# Altium project sdram.PrjPcb
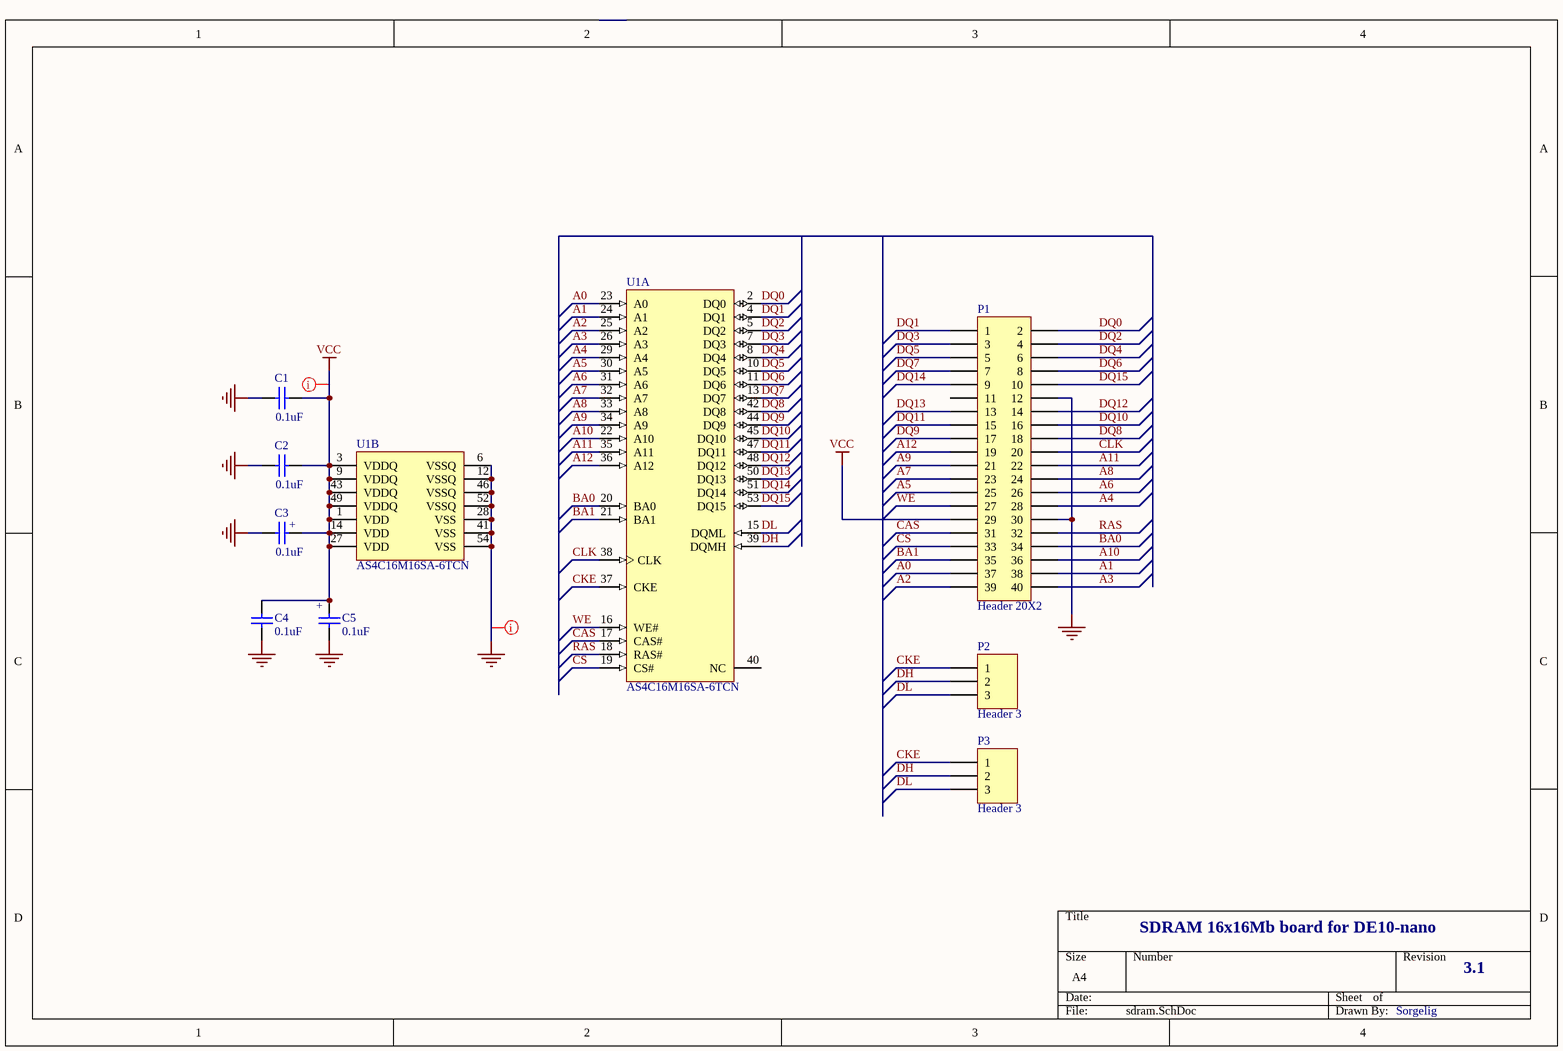
[diagram p0: sdram.SchDoc]
1 sheet, 9 parts. Net scope: global (net labels, ports and power ports of the same name join across sheets).
Board file: sdram.PcbDoc

## Sheet sdram.SchDoc
size A4

### Parts
C1  value 0.1uF  [0805]  (hidden comment: C0805)
C2  value 0.1uF  [0805]  (hidden comment: C0805)
C3  +  value 0.1uF  [0805]
C4  value 0.1uF  [0805]  (hidden comment: C0805)
C5  +  value 0.1uF  [0805]
P1  Header 20X2  [HDR2X20]
P2  Header 3  [HDR1X3]
P3  Header 3  [HDR1X3]
U1  AS4C16M16SA-6TCN  [MICT-P-54_N]  (parts A,B of 2)

### Nets
GND: C1.1 C2.1 C3.1 C4.1 C5.1 P1.12 P1.30 U1.6(VSSQ) U1.12(VSSQ) U1.28(VSS) U1.41(VSS) U1.46(VSSQ) U1.52(VSSQ) U1.54(VSS)
VCC: C1.2 C2.2 C3.2 C4.2 C5.2 P1.29 U1.1(VDD) U1.3(VDDQ) U1.9(VDDQ) U1.14(VDD) U1.27(VDD) U1.43(VDDQ) U1.49(VDDQ)
A0: P1.37 U1.23(A0)
A1: P1.38 U1.24(A1)
A2: P1.39 U1.25(A2)
A3: P1.40 U1.26(A3)
A4: P1.28 U1.29(A4)
A5: P1.25 U1.30(A5)
A6: P1.26 U1.31(A6)
A7: P1.23 U1.32(A7)
A8: P1.24 U1.33(A8)
A9: P1.21 U1.34(A9)
A10: P1.36 U1.22(A10)
A11: P1.22 U1.35(A11)
A12: P1.19 U1.36(A12)
BA0: P1.34 U1.20(BA0)
BA1: P1.35 U1.21(BA1)
CAS: P1.31 U1.17(CAS#)
CKE: P2.1 P3.1 U1.37(CKE)
CLK: P1.20 U1.38(CLK)
CS: P1.33 U1.19(CS#)
DH: P2.2 P3.2 U1.39(DQMH)
DL: P2.3 P3.3 U1.15(DQML)
DQ0: P1.2 U1.2(DQ0)
DQ1: P1.1 U1.4(DQ1)
DQ2: P1.4 U1.5(DQ2)
DQ3: P1.3 U1.7(DQ3)
DQ4: P1.6 U1.8(DQ4)
DQ5: P1.5 U1.10(DQ5)
DQ6: P1.8 U1.11(DQ6)
DQ7: P1.7 U1.13(DQ7)
DQ8: P1.18 U1.42(DQ8)
DQ9: P1.17 U1.44(DQ9)
DQ10: P1.16 U1.45(DQ10)
DQ11: P1.15 U1.47(DQ11)
DQ12: P1.14 U1.48(DQ12)
DQ13: P1.13 U1.50(DQ13)
DQ14: P1.9 U1.51(DQ14)
DQ15: P1.10 U1.53(DQ15)
RAS: P1.32 U1.18(RAS#)
WE: P1.27 U1.16(WE#)

Not connected (* = marked no-connect by the designer): P1 11; U1 40(NC)

### Layout directives
net class power: GND, VCC

### Notes on the sheet
- SDRAM 16x16Mb board for DE10-nano
- 3.1
- Sorgelig

### Library data of the parts
C1-C5 = C0805: Ceramic Chip Capacitor - Standard; Note: Footprint corresponds to dimensions for bulk cassette packaging. This case size has tightened tolerances.; Published: 17-Jul-2002; LatestRevisionDate: 19-Mar-2004; LatestRevisionNote: Silkscreen size reduced.; DatasheetDocument: Mar-2001; PackageDocument: Mar-2001; PackageReference: 0805; Publisher: Altium Limited; Code_JEITA: 0805; Code_IPC: 2012[0805]; ComponentLink1Description: Manufacturer Link; ComponentLink1URL: http://www.kemet.com/; ComponentLink2Description: Datasheet; ComponentLink2URL: http://www.kemet.com/kemet/web/homepage/kechome.nsf/vapubfilesname/F3102TA.pdf/$file/F3102TA.pdf
P1 = Header 20X2: Header, 20-Pin, Dual row; LatestRevisionDate: 17-Jul-2002; LatestRevisionNote: Re-released for DXP Platform.; Publisher: Altium Limited
P2 P3 = Header 3: Header, 3-Pin; LatestRevisionDate: 17-Jul-2002; LatestRevisionNote: Re-released for DXP Platform.; Publisher: Altium Limited
U1 = MT48LC16M16A2P-6A: 256Mb PC133 SDR SDRAM, 16Mb x 16, 6ns, 3.3V, 0 to 70 degC, 54-Pin TSOP, Pb-Free; Manufacturer: Micron; CL: CL = 3; Clock Rate: 167 MHz; Op. Temp.: 0C to +70C; DatasheetVersion: Rev.Q; PackageVersion: Rev.Q; PackageReference: MICT-P-54; PackageDescription: 54-Pin Thin Small Outline Package, 10.16 x 22.22 mm, Pitch 0.8 mm; Cycle Time: 6ns; Data Rate: PC133; Density: 256Mb; Depth: 16Mb; RoHS: Yes; Voltage: 3.3V; Width: x16; Mounting Technology: Surface Mount; PartNumber: MT48LC16M16A2P-6A; ComponentLink1Description: Manufacturer URL; ComponentLink1URL: http://www.micron.com/; ComponentLink2Description: Datasheet; ComponentLink2URL: http://www.micron.com/~/media/Documents/Products/Data%20Sheet/DRAM/256Mb_sdr.pdf; ComponentLink3Description: Package Specification; ComponentLink3URL: http://www.micron.com/~/media/Documents/Products/Data%20Sheet/DRAM/128mb_x4x8x16_sdram.pdf